# Altium schematic sheet Servo.SchDoc
size A
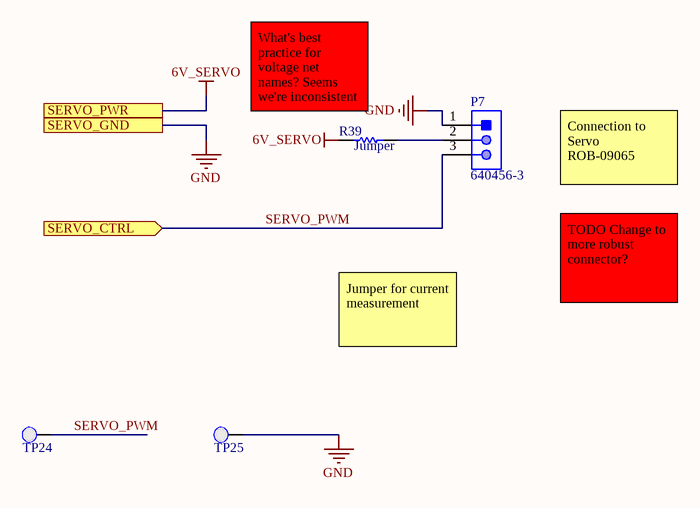
[diagram p0: Servo.SchDoc]

## Parts
P7  640456-3  [TECO-640456-3]
R39  Jumper  [RESC0603(1608)_N]
TP24  0.1" Pad  [PCBComponent]  (value not drawn)
TP25  0.1" Pad  [PCBComponent]  (value not drawn)

## Ports
SERVO_CTRL (in), SERVO_GND, SERVO_PWR

## Nets
6V_SERVO: R39.1 ; port SERVO_PWR
GND: P7.1 TP25.1(PAD) ; port SERVO_GND
SERVO_PWM: P7.3 TP24.1(PAD) ; port SERVO_CTRL
NetP7_2: P7.2 R39.2

## Notes on the sheet
- (near R39) What's best practice for voltage net names? Seems we're inconsistent
- Connection to Servo
  ROB-09065
- Jumper for current measurement
- TODO Change to more robust connector?

## Library data of the parts
P7 = CMP-2000-05418-1: Male Header, Pitch 2.54 mm, 1 x 3 Position, Height 10.03 mm, Tail Length 3.56 mm, -55 to 105 degC; Manufacturer: TE Connectivity; Agency Approvals: CSA,UL; Angle: Straight; Number of Positions: 3; Standards: RoHSCompliant,ELVCompliant,UL94V-0; Current, Rating: 5 / A; Connector Type: MTA-100; Mount Angle: Vertical; Material, Housing: Polyester; Temperature, Operating: -55to+105 / degC; Voltage, Rating: 250 / V; Color, Housing: White; Contact Centerline Spacing: 0.100 / in.; Special Features: Pinstrip; Material, Contact: CopperAlloy; Contact Termination Area Plating: Tin; Primary Type: InterconnectSystem; Pin Spacing: 0.1 / "; Brand/Series: MTA-100Series; Mounting Hole Size: 0.04 / "; Manufacturer URL: http://www.te.com/; Datasheet URL: https://datasheet.ciiva.com/16456/eng-ds-82056-mta-0608-16456886.pdf; Flammability Rating: UL94V-0; Mounting Type: PCMount; Contact Mating Area Plating: Tin; Datasheet Version: Jun-08; Number of Rows: 1; Termination: Solder; Type: PCBPlug; Length, Pin: 0.14 / "; Color: White; Contact Plating: Tin; Contact Shape: Square; Number of Contacts: 3; Size, Post: 0.025 / in.; Length, Terminal Post: 0.14 / in.; Length, Overall: 0.3 / "
R39 = CMP-1012-00001-1: Jumper 0603 (1608 Metric); Case-Metric: 1608; Value: 0.00 Ohm; Power: None; Case-EIA: 0603; Technology: SMT; Tolerance: None
TP24 TP25 = 0.1" Pad-A.4